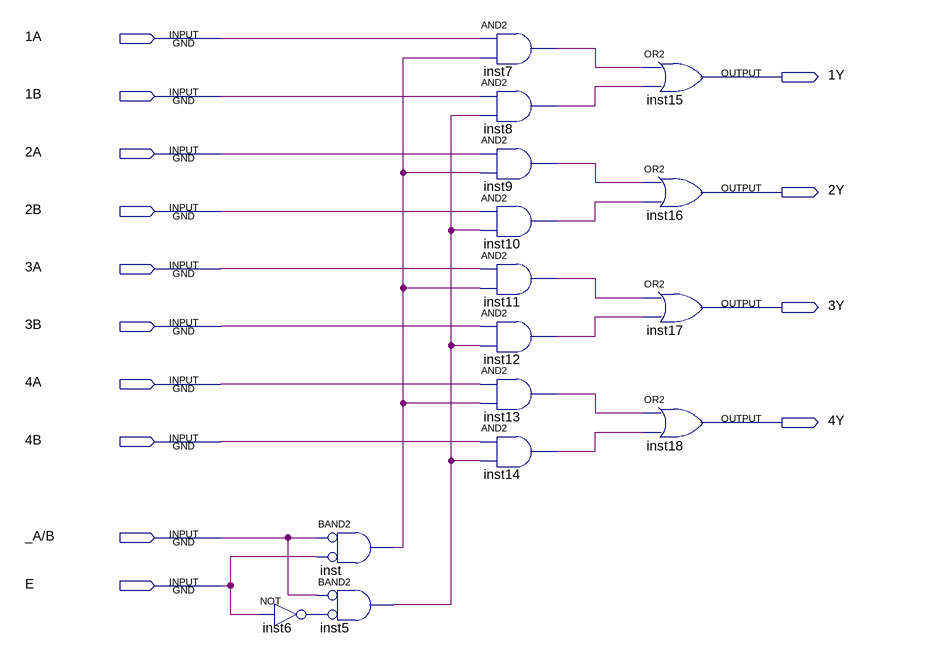
[diagram p0: schematic sheet]
// Quartus schematic 74LS157.bdf as structural Verilog: 15 symbols, 14 pins
module \74LS157  (
  input  \1A ,
  input  \1B ,
  input  \2A ,
  input  \2B ,
  input  \3A ,
  input  \3B ,
  input  \4A ,
  input  \4B ,
  input  \_A/B ,
  input  E,
  output \1Y ,
  output \2Y ,
  output \3Y ,
  output \4Y 
);

  wire inst5_out, inst6_out, inst7_out, inst8_out, inst9_out, inst10_out, inst11_out, inst12_out, inst13_out,
       inst14_out, inst_out;

  not inst6 (inst6_out, E);
  and inst (inst_out, ~\_A/B , ~E);  // BAND2
  and inst5 (inst5_out, ~\_A/B , ~inst6_out);  // BAND2
  and inst7 (inst7_out, \1A , inst_out);
  and inst8 (inst8_out, \1B , inst5_out);
  and inst9 (inst9_out, \2A , inst_out);
  and inst10 (inst10_out, \2B , inst5_out);
  and inst11 (inst11_out, \3A , inst_out);
  and inst12 (inst12_out, \3B , inst5_out);
  and inst13 (inst13_out, \4A , inst_out);
  and inst14 (inst14_out, \4B , inst5_out);
  or inst15 (\1Y , inst7_out, inst8_out);
  or inst16 (\2Y , inst9_out, inst10_out);
  or inst17 (\3Y , inst11_out, inst12_out);
  or inst18 (\4Y , inst13_out, inst14_out);
endmodule
